# EAGLE design LiFePO4 Power (EAGLE 7.1.0)
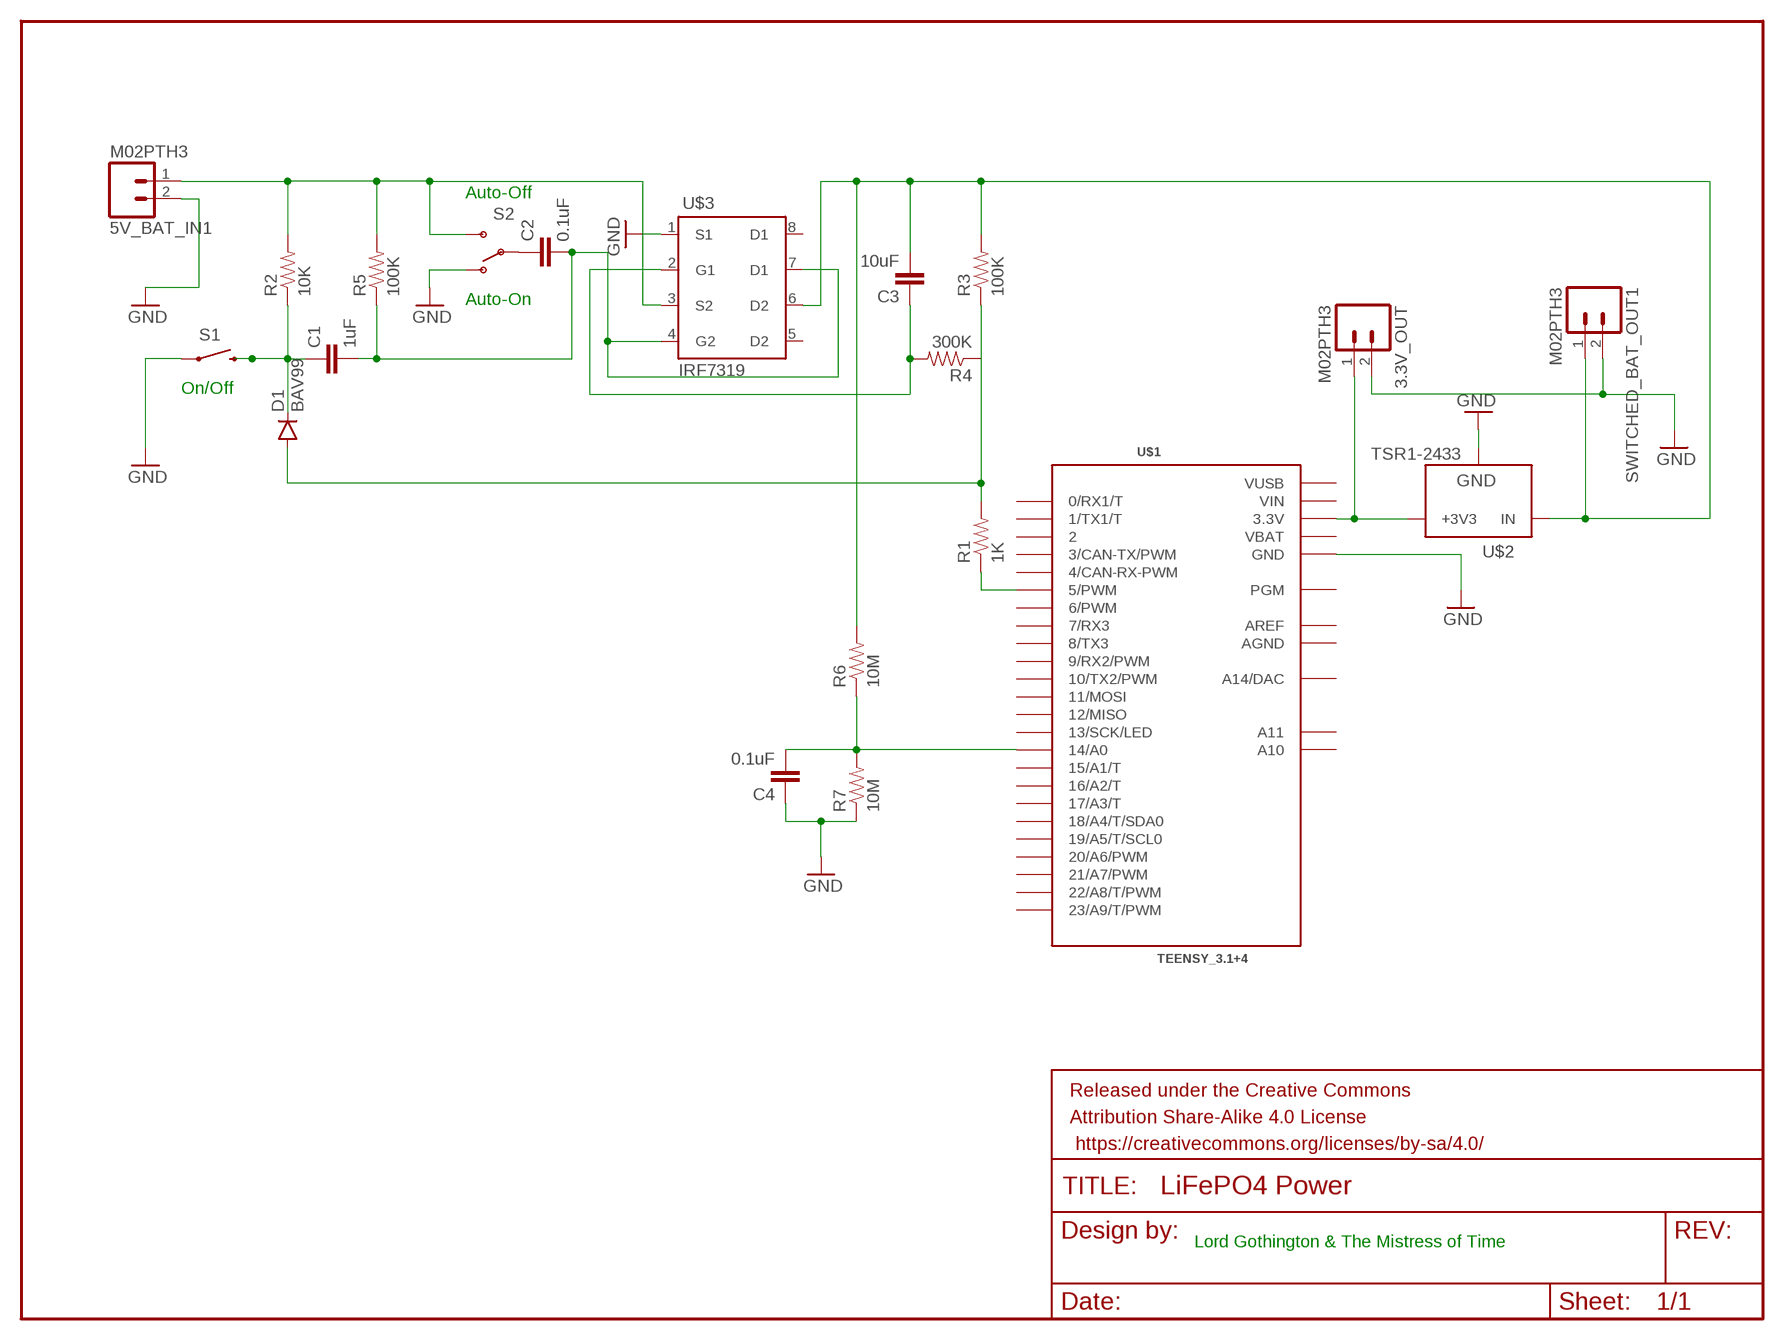
[diagram p0: schematic, sheet 1]

## Parts
3.3V_OUT  M02PTH3  [1X02_LONGPADS]
5V_BAT_IN1  M02PTH3  [1X02_LONGPADS]
C1  1uF  CAP0805  [0805]
C2  0.1uF  CAP0805  [0805]
C3  10uF  CAP0805  [0805]
C4  0.1uF  CAP0805  [0805]
D1  BAV99  DIODESMA  [SMA-DIODE]
FRAME1  FRAME-LETTER  [CREATIVE_COMMONS]
R1  1K  RESISTOR0805-RES  [0805]
R2  10K  RESISTOR0805-RES  [0805]
R3  100K  RESISTOR0805-RES  [0805]
R4  300K  RESISTOR0805-RES  [0805]
R5  100K  RESISTOR0805-RES  [0805]
R6  10M  RESISTOR0805-RES  [0805]
R7  10M  RESISTOR0805-RES  [0805]
S1  SWITCH-MOMENTARY-2SMD  [TACTILE-SWITCH-SMD]
S2  SWITCH-SPDTSMD2  [SWITCH-SPDT-SMD]
SWITCHED_BAT_OUT1  M02PTH3  [1X02_LONGPADS]
U$1  TEENSY_3.1+4  [TEENSY_3.1+4]
U$2  TSR1-2433  [TSR-1]
U$3  IRF7319  [SO08]

## Nets
GND: 3.3V_OUT.2 5V_BAT_IN1.2 C4.1 R7.1 S1.1 S2.1(O) SWITCHED_BAT_OUT1.2 U$1.GND U$1.GND1(GND) U$2.2(GND) U$3.1(S1)
N$1: 3.3V_OUT.1 U$1.3.3V U$1.3.3V1(3.3V) U$2.3(+3V3)
N$2: R1.1 U$1.5(5/PWM)
N$3: C3.2 R3.2 R6.2 SWITCHED_BAT_OUT1.1 U$2.1(IN) U$3.6(D2)
N$4: C1.1 D1.C R2.1 S1.3
N$5: C4.2 R6.1 R7.2 U$1.14/A0
N$6: 5V_BAT_IN1.1 R2.2 R5.2 S2.3(S) U$3.3(S2)
N$7: C1.2 C2.2 R5.1 U$3.4(G2) U$3.7(D1)
N$9: C2.1 S2.2(P)
N$10: D1.A R1.2 R3.1 R4.1
N$11: C3.1 R4.2 U$3.2(G1)
Unconnected: U$1.0(0/RX1/T) U$1.1(1/TX1/T) U$1.2 U$1.3(3/CAN-TX/PWM) U$1.4(4/CAN-RX-PWM) U$1.6(6/PWM) U$1.7(7/RX3) U$1.8(8/TX3) U$1.9(9/RX2/PWM) U$1.10(10/TX2/PWM) U$1.11(11/MOSI) U$1.12(12/MISO) U$1.13(13/SCK/LED) U$1.15/A1(15/A1/T) U$1.16/A2(16/A2/T) U$1.17/A3(17/A3/T) U$1.18/A4(18/A4/T/SDA0) U$1.19/A5(19/A5/T/SCL0) U$1.20/A6(20/A6/PWM) U$1.21/A7(21/A7/PWM) U$1.22/A8(22/A8/T/PWM) U$1.23/A9(23/A9/T/PWM) U$1.A10 U$1.A11 U$1.A14(A14/DAC) U$1.PGM U$3.5(D2) U$3.8(D1)

## Notes on the sheet
- Auto-Off
- Auto-On
- On/Off
- Lord Gothington & The Mistress of Time

## Power pins joined to a net without a drawn wire
AGND: U$1.AGND
AREF: U$1.AREF
VBAT: U$1.VBAT
VIN: U$1.VIN
VUSB: U$1.VUSB

## Library data of the parts
3.3V_OUT 5V_BAT_IN1 SWITCHED_BAT_OUT1 = SparkFun-Connectors:M02: Standard 2-pin 0.1" header. Use with - straight break away headers ( PRT-00116) - right angle break away headers (PRT-00553) - swiss pins (PRT-00743) - machine pins (PRT-00117) - female headers (PRT-00115) Molex polarized connector foot print use with: PRT-08233 with associated crimp pins and housings. 2.54_SCREWTERM for use with PRT-10571. 3.5mm Screw Terminal footprints for PRT-08084 5mm Screw Terminal footprints for use with PRT-08433
C1-C4 = SparkFun-Capacitors:CAP: Capacitor Standard 0603 ceramic capacitor, and 0.1" leaded capacitor.
D1 = SparkFun-DiscreteSemi:DIODE: Diode These are standard reverse protection diodes and small signal diodes. SMA package can handle up to about 1A. SOD-323 can handle about 200mA. What the SOD-323 package when ordering, there are some mfgs out there that are 5-pin packages.
FRAME1 = SparkFun-Aesthetics:FRAME-LETTER: Schematic Frame Standard 8.5x11 US Letter frame
R1-R7 = SparkFun-Resistors:RESISTOR: Resistor Basic schematic elements and footprints for 0603, 1206, and PTH resistors.
S1 = SparkFun-Electromechanical:SWITCH-MOMENTARY-2: Various NO switches- pushbuttons, reed, etc
S2 = SparkFun-Electromechanical:SWITCH-SPDT: SPDT Switch Simple slide switch, Spark Fun Electronics SKU : COM-00102 DPDT SMT slide switch, AYZ0202, SWCH-08179
U$1 = Teensy_3_Series_Board_v1.0:TEENSY_3.1+4: Footprint for Teensy 3.1 board using all through-holes, i.e. the entire perimeter plus the 4 through-holes inboard (A10,A11,AREF, VUSB)
U$2 = SteelCaveRobotics-Power:TSR1-2433: Traco Power TSR 1-2433 3.3v switching regulator
U$3 = n-heptane:IRF7319: IRF7319 Dual HEXFET Power MOSFET. http://www.irf.com/product-info/datasheets/data/irf7319.pdf

## Board
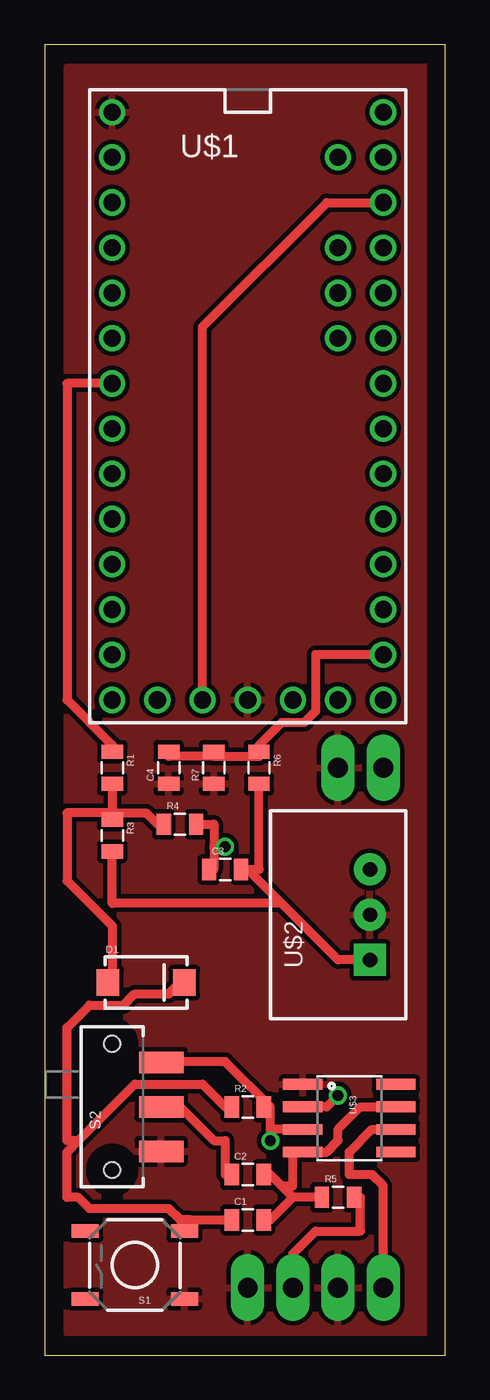
[diagram p1: board, top side]
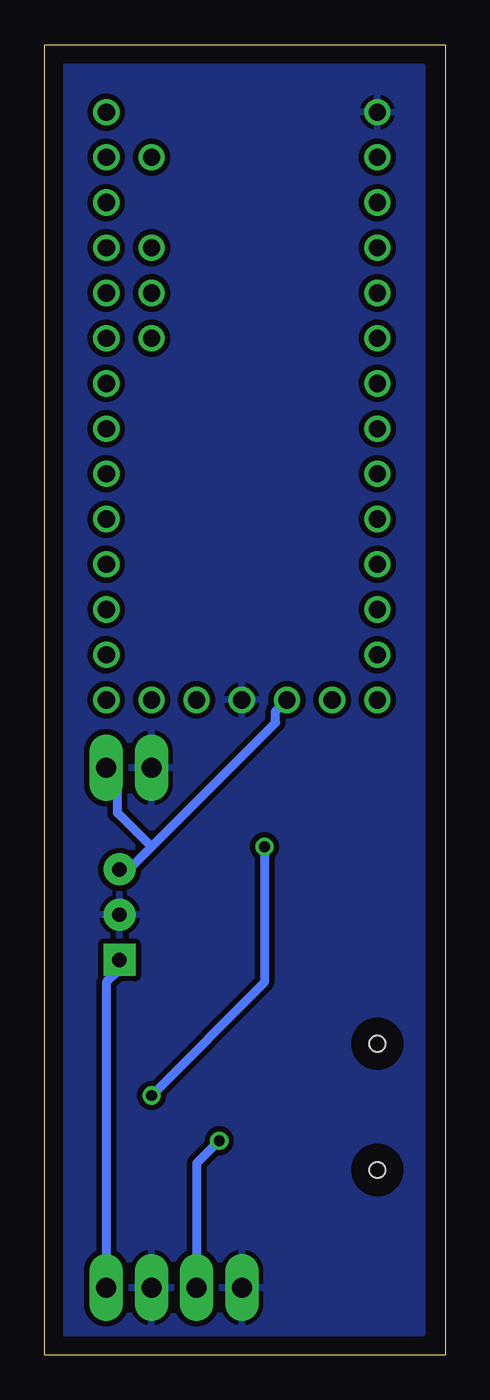
[diagram p2: board, bottom side, seen from below]

Size 22.53 x 73.65 mm. Coordinates in mm from the lower left corner, seen from the top.
Outline: 0,0 22.53,0 22.53,73.65 0,73.65 0,0
Copper layers (1*16): Top 0.035mm / dielectric 1.5mm / Bottom 0.035mm
Design rules "default *": minimum track width 20mil, minimum drill 24mil, track to track 10mil, track to pad 10mil, pad to pad 8mil, via to via 8mil, smd to smd 8mil, copper to edge 40mil, drill to drill 8mil, minimum pad ring 10mil, minimum via ring 8mil, stop-mask expansion 4mil, vias tented up to drill 0mil, thermal gap 10mil

### Footprints (pad centres in the part's own frame; a part is rotated, then mirrored left to right if it is on the bottom)
1X02_LONGPADS = drill 1.118 pad 1.88 long: 1 0,0; 2 2.54,0
0805 = smd 0.8 x 1.2: 1 -0.9,0; 2 0.9,0
SMA-DIODE = smd 1.27 x 1.47: A -2.15,0; C 2.15,0
TACTILE-SWITCH-SMD = smd 1.524 x 0.762: 1 -2.794,1.905; 2 2.794,1.905; 3 -2.794,-1.905; 4 2.794,-1.905
SWITCH-SPDT-SMD = smd 1.2 x 2.5: 1 -2.5,-2.75; 2 0,-2.75; 3 2.5,-2.75 | hole 0.9: -3.55,0; 3.55,0
TEENSY_3.1+4 = drill 0.965: 0 -7.62,15.24; 1 -7.62,12.7; 2 -7.62,10.16; 3 -7.62,7.62; 3.3V 7.62,12.7; 3.3V1 -2.54,-15.24; 4 -7.62,5.08; 5 -7.62,2.54; 6 -7.62,0; 7 -7.62,-2.54; 8 -7.62,-5.08; 9 -7.62,-7.62; 10 -7.62,-10.16; 11 -7.62,-12.7; 12 -7.62,-15.24; 13 7.62,-15.24; 14/A0 7.62,-12.7; 15/A1 7.62,-10.16; 16/A2 7.62,-7.62; 17/A3 7.62,-5.08; 18/A4 7.62,-2.54; 19/A5 7.62,0; 20/A6 7.62,2.54; 21/A7 7.62,5.08; 22/A8 7.62,7.62; 23/A9 7.62,10.16; A10 5.08,7.62; A11 5.08,5.08; A14 5.08,-15.24; AGND 7.62,15.24; AREF 5.08,10.16; GND -7.62,17.78; GND1 0,-15.24; PGM 2.54,-15.24; VBAT -5.08,-15.24; VIN 7.62,17.78; VUSB 5.08,15.24
TSR-1 = drill 0.8 pad 1.8 square: 1 -2.54,-1.8 | drill 0.8 pad 1.8: 2 0,-1.8; 3 2.54,-1.8
SO08 = smd 0.61 x 2.21: 1 -1.905,-2.616; 2 -0.635,-2.616; 3 0.635,-2.616; 4 1.905,-2.616; 5 1.905,2.616; 6 0.635,2.616; 7 -0.635,2.616; 8 -1.905,2.616

### Placement (x,y rotation side)
3.3V_OUT  19.05,33.02 180 top
5V_BAT_IN1  13.97,3.81 180 top
C1  11.43,7.62 0 top
C2  11.43,10.16 0 top
C3  10.16,27.3 0 top
C4  6.99,33.02 90 top
D1  5.71,20.95 0 top
FRAME1  -77.47,31.75 0 top  (outside the outline)
R1  3.81,33.02 270 top
R2  11.43,13.97 0 top
R3  3.81,29.21 270 top
R4  7.62,29.84 0 top
R5  16.51,8.89 0 top
R6  12.06,33.02 270 top
R7  9.53,33.02 90 top
S1  5.08,5.08 180 top
S2  3.81,13.97 90 top
SWITCHED_BAT_OUT1  19.05,3.81 180 top
U$1  11.43,52.07 0 top
U$2  16.51,24.77 90 top
U$3  17.14,13.33 270 top

### Tracks (layer width: path | path; a pad name or v marks a point on that pad's centre or on a via)
GND
  pour Bottom (isolate 0.305): 1.27,72.39 21.59,72.39 21.59,1.27 1.27,1.27
  pour Top: 1.27,72.39 21.59,72.39 21.59,1.27 1.27,1.27
N$1
  Top 0.508: U$1.3.3V 15.88,64.77 8.89,57.79 U$1.3.3V1
  Bottom 0.508: U$1.3.3V1 9.53,36.2 9.53,35.56 16.51,28.57 | 16.51,28.57 17.78,27.3 U$2.3 | 3.3V_OUT.1 18.41,32.38 18.41,30.48 16.51,28.57
N$2
  Top 0.508: U$1.5 1.27,54.61 1.27,36.83 3.81,34.29 R1.1
N$3
  Top 0.508: U$3.6 18.41,12.7 17.14,11.43 17.14,10.16 18.41,10.16 19.05,9.53 SWITCHED_BAT_OUT1.1 | 13.34,25.4 16.51,22.23 U$2.1 | 13.34,25.4 11.43,27.3 | R3.2 3.81,25.4 13.34,25.4 | R6.2 12.06,27.3 11.43,27.3 | 11.43,27.3 C3.2
  Bottom 0.508: SWITCHED_BAT_OUT1.1 19.05,20.95 18.41,21.59 18.41,22.23 U$2.1
N$4
  Top 0.508: 8.26,7.62 C1.1 | 8.26,7.62 7.62,6.99 S1.3 | 1.91,12.06 1.27,11.43 1.27,8.89 1.91,8.89 2.54,8.26 6.99,8.26 7.62,7.62 8.26,7.62 | 1.91,12.06 5.08,15.24 8.89,15.24 10.16,13.97 R2.1 | 1.91,12.06 1.27,12.06 1.27,18.41 2.54,19.69 4.45,19.69 5.08,20.32 6.99,20.32 7.62,20.95 D1.C
N$5
  Top 0.508: 9.53,33.66 6.99,33.66 C4.2 | 9.53,33.66 12.06,33.66 R6.1 12.06,34.29 13.34,35.56 14.61,35.56 15.24,36.2 15.24,39.37 U$1.14/A0 | 9.53,33.66 R7.2
N$6  (via drill 0.61)
  Top 0.508: 5V_BAT_IN1.1 13.97,5.71 15.24,6.99 17.78,6.99 17.78,8.89 R5.2 | 12.7,12.7 12.7,13.97 | U$3.3 12.7,12.7 | 12.7,13.97 10.16,16.51 6.99,16.51 S2.3 | 12.7,13.97 R2.2 | 12.7,12.7 v12.7,12.06
  Bottom 0.508: 5V_BAT_IN1.1 13.97,10.79 v12.7,12.06
N$7
  Top 0.508: 13.97,8.89 12.7,7.62 C1.2 | R5.1 13.97,8.89 | 13.97,8.89 13.34,9.53 | 13.34,9.53 12.7,10.16 C2.2 | 13.34,9.53 13.97,9.53 13.97,11.43 U$3.4 15.88,11.43 16.51,12.06 16.51,12.7 17.78,13.97 U$3.7
N$9
  Top 0.508: S2.2 7.62,13.97 9.53,12.06 10.16,12.06 10.16,10.16 C2.1
N$10
  Top 0.508: R1.2 3.81,30.48 | 3.81,30.48 5.71,30.48 6.35,29.84 R4.1 | 3.81,30.48 1.27,30.48 1.27,26.67 3.81,24.13 3.81,20.95 D1.A | 3.81,30.48 R3.1
N$11  (via drill 0.61)
  Top 0.508: 9.53,28.57 9.53,29.84 R4.2 | 9.53,28.57 9.53,27.3 C3.1 | U$3.2 15.88,13.97 v16.51,14.6 | 9.53,28.57 v10.16,28.57
  Bottom 0.508: v16.51,14.6 10.16,20.95 v10.16,28.57